# EAGLE design Thermal_Stage_rev3 (EAGLE 5.06)
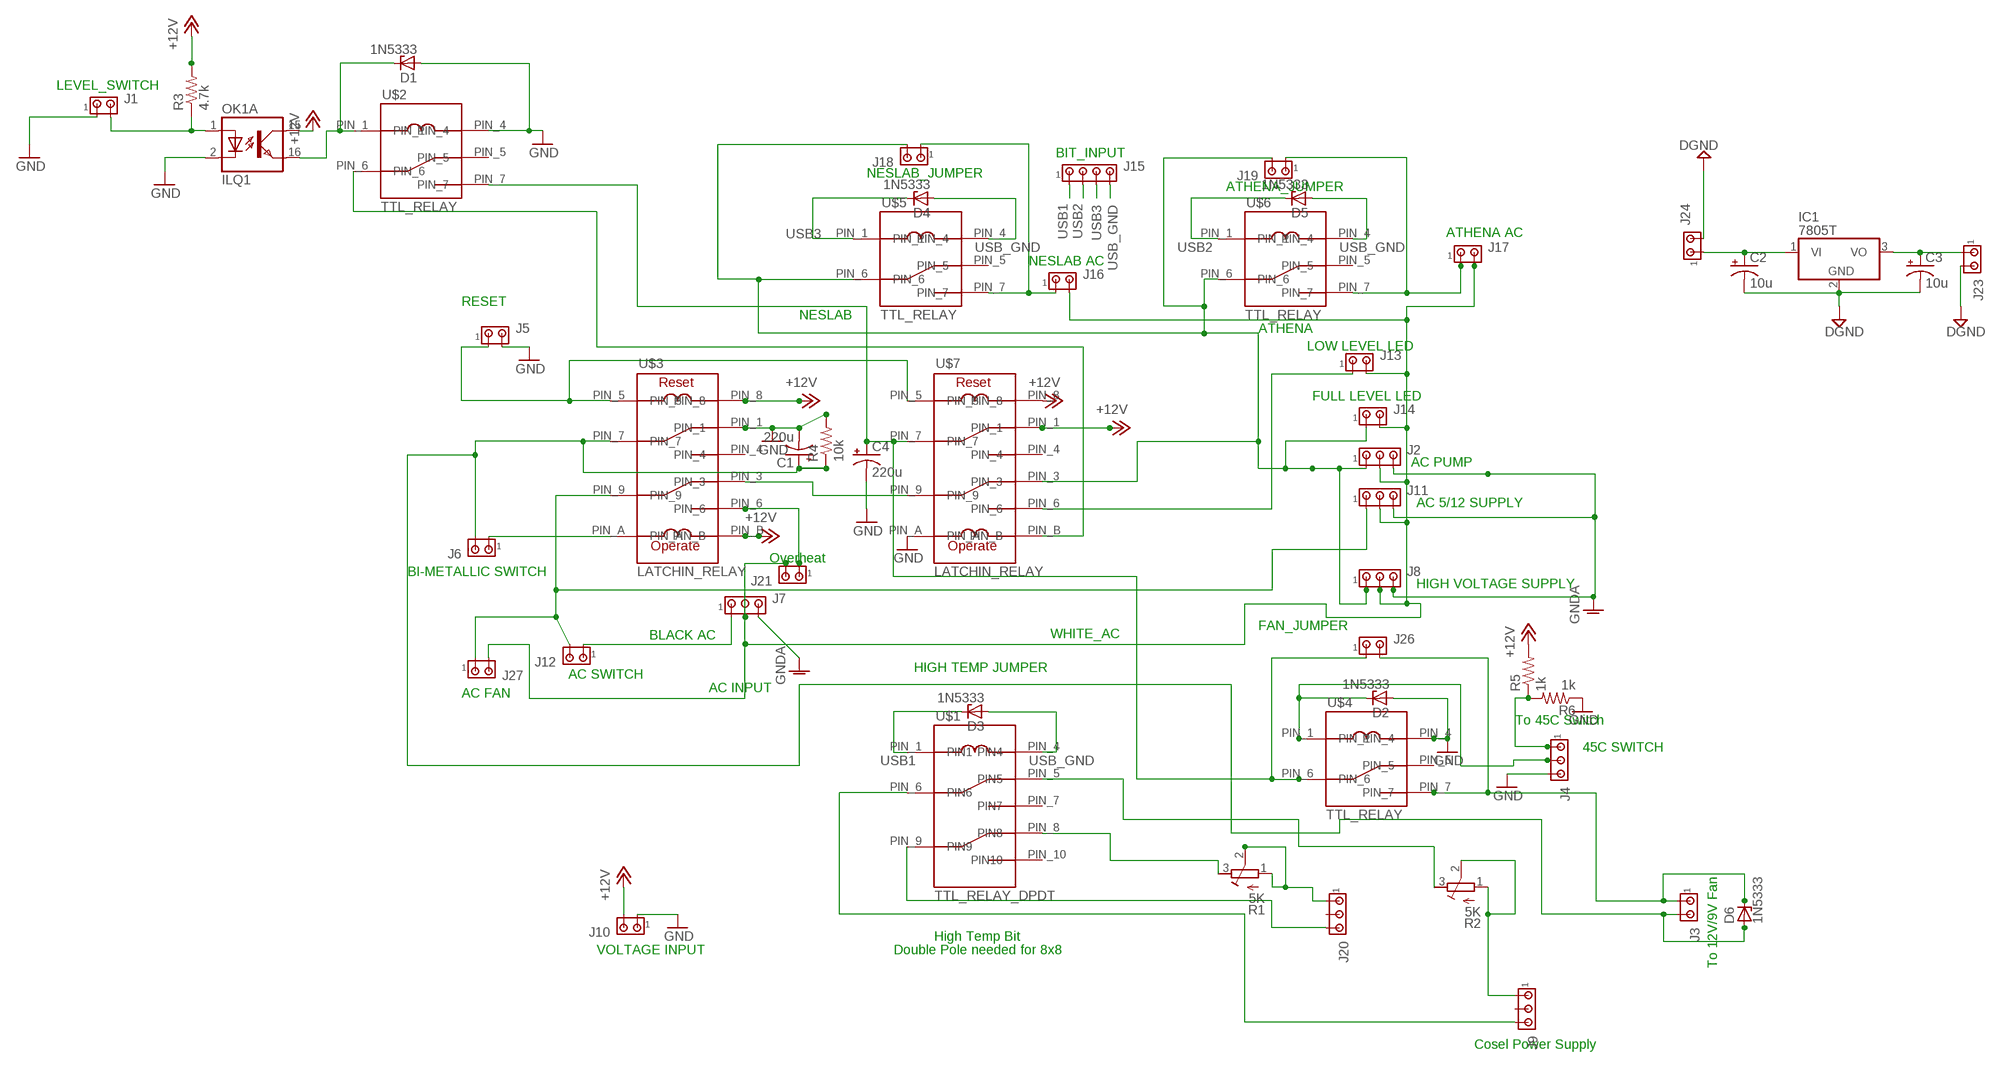
[diagram p0: schematic, sheet 1]

## Parts
C1  220u  CPOL-USE5-13  [E5-13]
C2  10u  CPOL-USE2,5-6E  [E2,5-6E]
C3  10u  CPOL-USE2,5-6E  [E2,5-6E]
C4  220u  CPOL-USE5-13  [E5-13]
D1  1N5333  [C1702-15]
D2  1N5333  [C1702-15]
D3  1N5333  [C1702-15]
D4  1N5333  [C1702-15]
D5  1N5333  [C1702-15]
D6  1N5333  [C1702-15]
IC1  7805T  [TO220H]
J1  MTA02-156  [1X2MTA]
J2  MTA03-156  [1X3MTA]
J3  MTA02-156  [1X2MTA]
J4  MTA03-156  [1X3MTA]
J5  MTA02-156  [1X2MTA]
J6  MTA02-156  [1X2MTA]
J7  MTA03-156  [1X3MTA]
J8  MTA03-156  [1X3MTA]
J9  MTA03-100  [10X03MTA]
J10  MTA02-156  [1X2MTA]
J11  MTA03-156  [1X3MTA]
J12  MTA02-156  [1X2MTA]
J13  MTA02-156  [1X2MTA]
J14  MTA02-156  [1X2MTA]
J15  MTA04-100  [10X04MTA]
J16  MTA02-156  [1X2MTA]
J17  MTA02-156  [1X2MTA]
J18  MTA02-100  [10X02MTA]
J19  MTA02-100  [10X02MTA]
J20  MTA03-100  [10X03MTA]
J21  MTA02-156  [1X2MTA]
J23  MTA02-100  [10X02MTA]
J24  MTA02-100  [10X02MTA]
J26  MTA02-100  [10X02MTA]
J27  MTA02-156  [1X2MTA]
OK1  ILQ1  [DIL16]
R1  5K  R-TRIMM3296W  [RTRIM3296W]
R2  5K  R-TRIMM3296W  [RTRIM3296W]
R3  4.7k  R-US_0204/7  [0204/7]
R4  10k  R-US_0204/7  [0204/7]
R5  1k  R-US_0204/7  [0204/7]
R6  1k  R-US_0204/7  [0204/7]
U$1  TTL_RELAY_DPDT  [TTL_RELAY_DPDT]
U$2  TTL_RELAY  [R1OS-E1Y1-J1.0K]
U$3  LATCHIN_RELAY  [785XBXCD-12D]
U$4  TTL_RELAY  [R1OS-E1Y1-J1.0K]
U$5  TTL_RELAY  [R1OS-E1Y1-J1.0K]
U$6  TTL_RELAY  [R1OS-E1Y1-J1.0K]
U$7  LATCHIN_RELAY  [785XBXCD-12D]

## Nets
+12V: J10.2 OK1.15(A:COL) R3.2 R5.2 U$3.PIN_8 U$3.PIN_B U$7.PIN_1 U$7.PIN_8
BLACK_AC: J7.1 J12.1
BLACK_AC_SWITCH: C1.+ D6.A J3.2 J6.2 R4.1 U$3.PIN_7
DGND: C2.- C3.- IC1.2(GND) J23.2 J24.2
GND: C1.- C4.- D1.A D2.A J1.1 J4.3 J5.2 J10.1 OK1.2(A:C) R4.2 R6.1 U$2.PIN_4 U$3.PIN_1 U$4.PIN_4 U$7.PIN_A
GNDA: J2.3 J7.3 J8.3 J11.3
N$1: D6.C J3.1 J26.2 U$4.PIN_7
N$2: J21.1 U$3.PIN_6
N$3: J20.1 R1.1(E) R1.2(S)
N$4: J5.1 U$3.PIN_5 U$7.PIN_5
N$5: U$2.PIN_6 U$7.PIN_B
N$6: J11.1 J12.2 J27.1 U$3.PIN_9
N$7: R1.3(A) U$1.PIN_8(PIN8)
N$8: D1.C OK1.16(A:EMIT) U$2.PIN_1
N$9: J13.1 U$7.PIN_6
N$10: J1.2 OK1.1(A:A) R3.1
N$11: C4.+ J26.1 U$2.PIN_7 U$4.PIN_6 U$7.PIN_7
N$12: J2.1 J8.1 J14.1 J18.2 J19.2 U$5.PIN_6 U$6.PIN_6 U$7.PIN_3
N$13: J9.3 U$1.PIN_6(PIN6)
N$14: J17.1 J19.1 U$6.PIN_7
N$15: J16.1 J18.1 U$5.PIN_7
N$17: D2.C J4.2 U$4.PIN_1
N$18: U$3.PIN_3 U$7.PIN_9
N$19: J20.3 U$1.PIN_9(PIN9)
N$20: J4.1 R5.1 R6.2
N$21: R2.3(A) U$1.PIN_5(PIN5)
N$22: J9.1 R2.1(E) R2.2(S)
N$24: C2.+ IC1.1(VI) J24.1
N$25: C3.+ IC1.3(VO) J23.1
N$26: J6.1 U$3.PIN_A
USB1: D3.C J15.1 U$1.PIN_1(PIN1)
USB2: D5.C J15.2 U$6.PIN_1
USB3: D4.C J15.3 U$5.PIN_1
USB_GND: D3.A D4.A D5.A J15.4 U$1.PIN_4(PIN4) U$5.PIN_4 U$6.PIN_4
WHITE_AC: J2.2 J7.2 J8.2 J11.2 J13.2 J14.2 J16.2 J17.2 J21.2 J27.2
Unconnected: J9.2 J20.2 OK1.3(B:C) OK1.4(B:A) OK1.5(C:A) OK1.6(C:C) OK1.7(D:C) OK1.8(D:A) OK1.9(D:EMIT) OK1.10(D:COL) OK1.11(C:COL) OK1.12(C:EMIT) OK1.13(B:EMIT) OK1.14(B:COL) U$1.PIN_7(PIN7) U$1.PIN_10(PIN10) U$2.PIN_5 U$3.PIN_4 U$4.PIN_5 U$5.PIN_5 U$6.PIN_5 U$7.PIN_4

## Notes on the sheet
- LEVEL_SWITCH
- BIT_INPUT
- NESLAB_JUMPER
- ATHENA_JUMPER
- ATHENA AC
- NESLAB AC
- RESET
- NESLAB
- ATHENA
- LOW LEVEL LED
- FULL LEVEL LED
- AC PUMP
- AC 5/12 SUPPLY
- Overheat
- BI-METALLIC SWITCH
- HIGH VOLTAGE SUPPLY
- FAN_JUMPER
- BLACK AC | WHITE_AC
- HIGH TEMP JUMPER
- AC SWITCH
- AC INPUT
- AC FAN
- To 45C Switch
- 45C SWITCH
- High Temp Bit
- VOLTAGE INPUT | Double Pole needed for 8x8
- To 12V/9V Fan
- Cosel Power Supply

## Library data of the parts
C1-C4 = rcl:CPOL-US: POLARIZED CAPACITOR, American symbol
D1-D6 = diode:1N5333: Z DIODE 3.3 V, 5W, 5 percent (Motorola)
IC1 = linear:78*: Positive VOLTAGE REGULATOR Source: http://cache.national.com/ds/LM/LM78L05.pdf http://www.fairchildsemi.com/ds/LM/LM7805.pdf
J1 J3 J5 J6 J10 J12-J14 J16 J17 J21 J27 = con-amp:MTA02-156: AMP connector; OC_FARNELL: unknown; OC_NEWARK: unknown
J2 J4 J7 J8 J11 = con-amp:MTA03-156: AMP connector; OC_FARNELL: unknown; OC_NEWARK: unknown
J9 J20 = con-amp:MTA03-100: AMP connector; OC_FARNELL: unknown; OC_NEWARK: unknown
J15 = con-amp:MTA04-100: AMP connector; OC_FARNELL: unknown; OC_NEWARK: unknown
J18 J19 J23 J24 J26 = con-amp:MTA02-100: AMP connector; OC_FARNELL: unknown; OC_NEWARK: unknown
OK1 = optocoupler:ILQ1: SIEMENS OPTO COUPLER
R1 R2 = resistor:R-TRIMM: Trimm resistor
R3-R6 = rcl:R-US_: RESISTOR, American symbol
U$1 = Anthony-Relay:TTL_RELAY_DPDT
U$2 U$4-U$6 = Anthony-Relay:TTL_RELAY
U$3 U$7 = Anthony-Relay:LATCHIN_RELAY

## Board
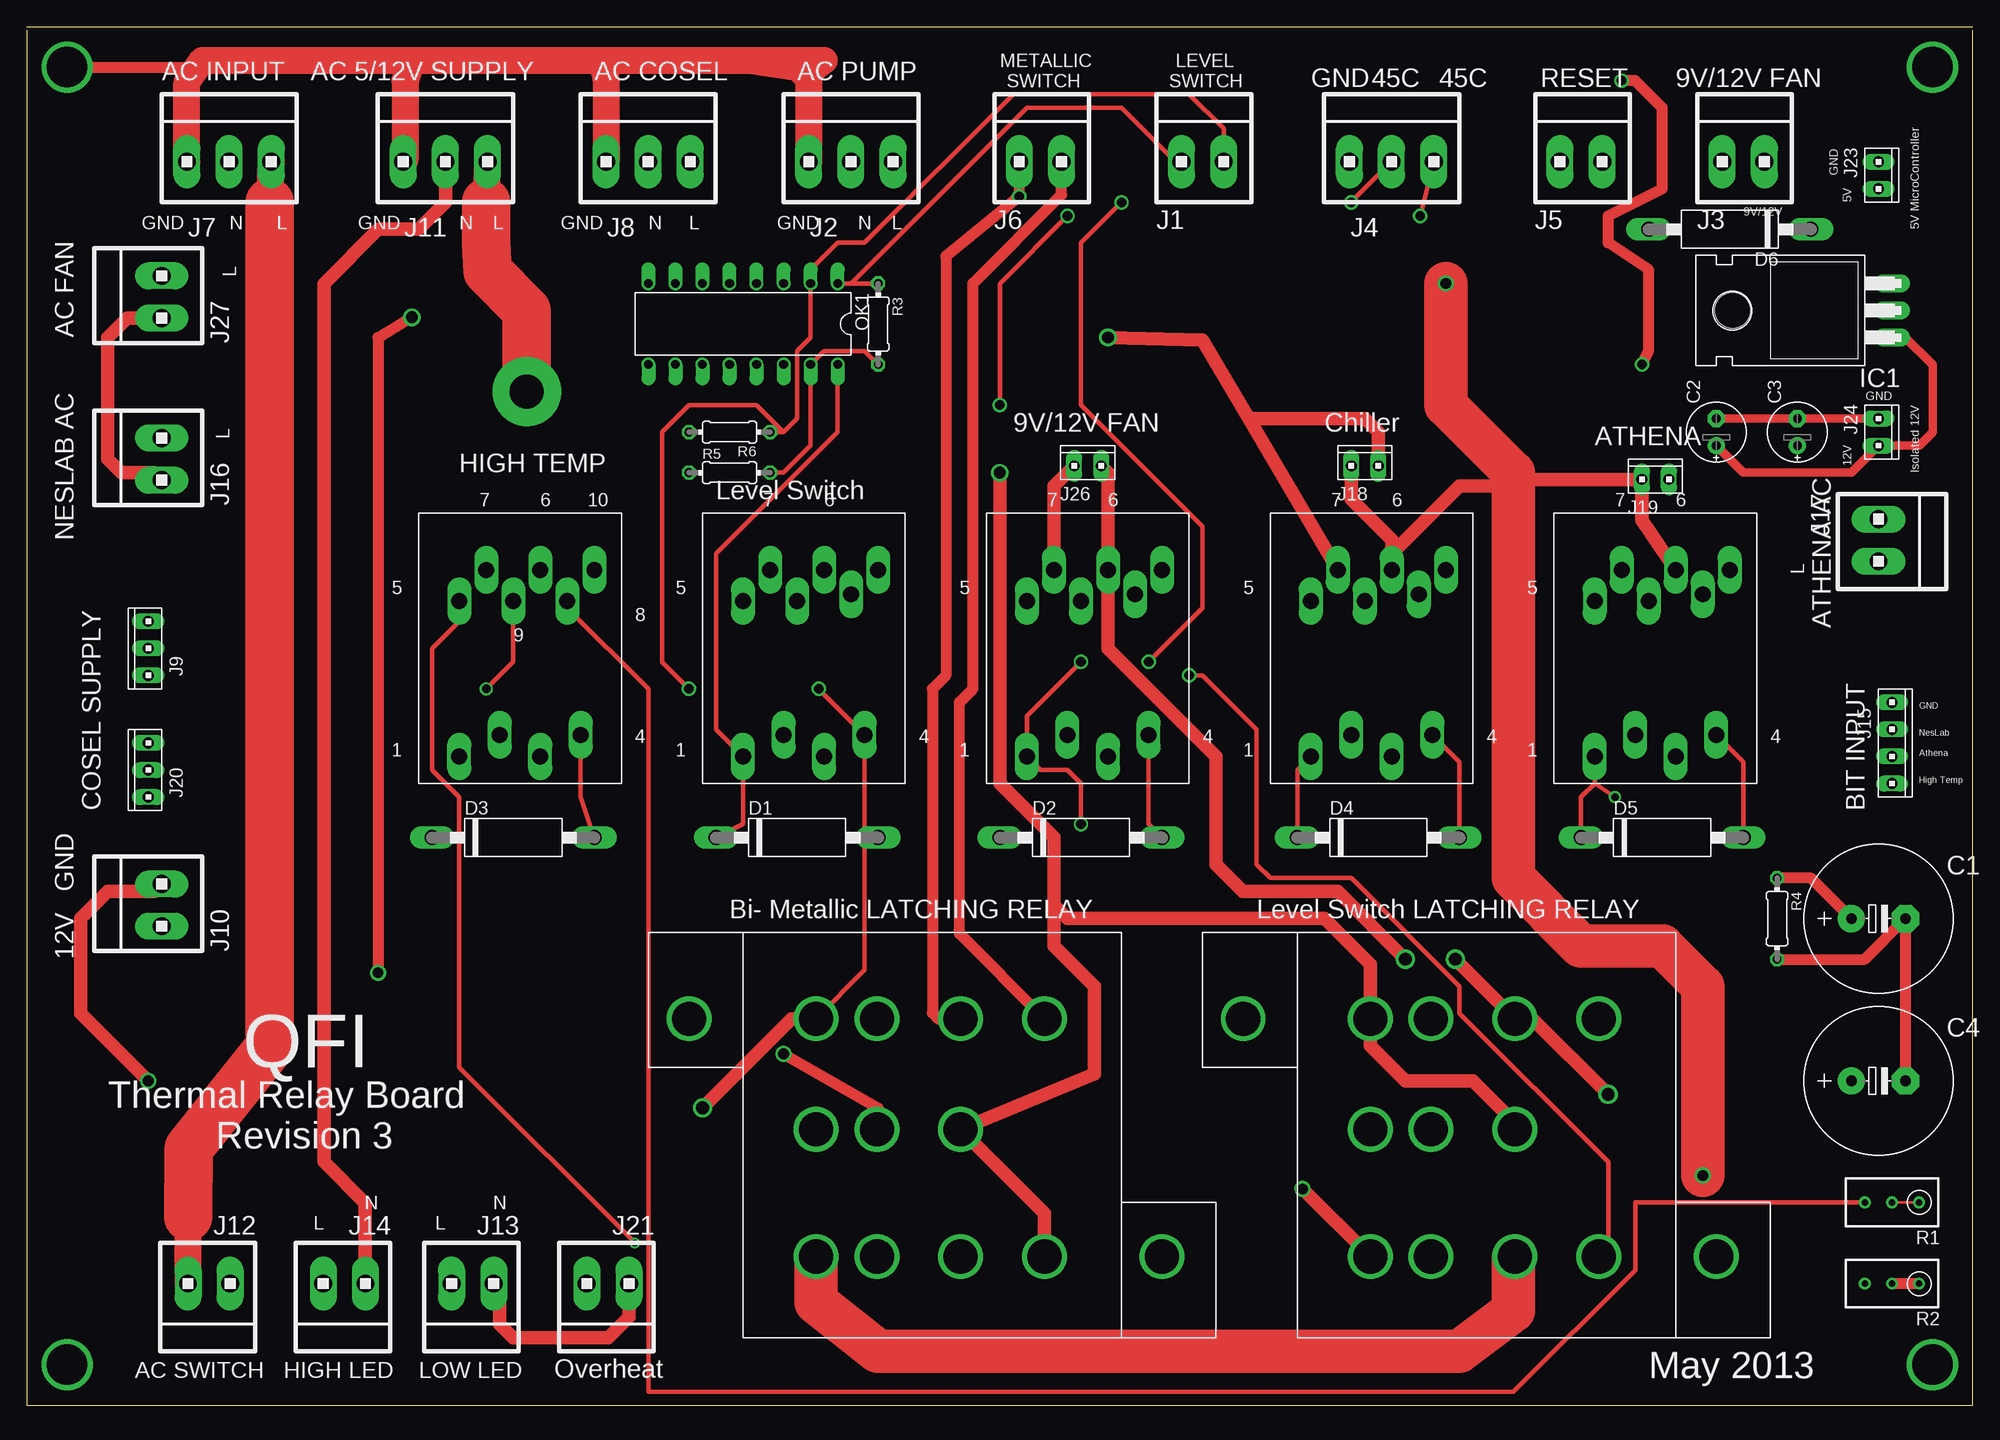
[diagram p1: board, top side]
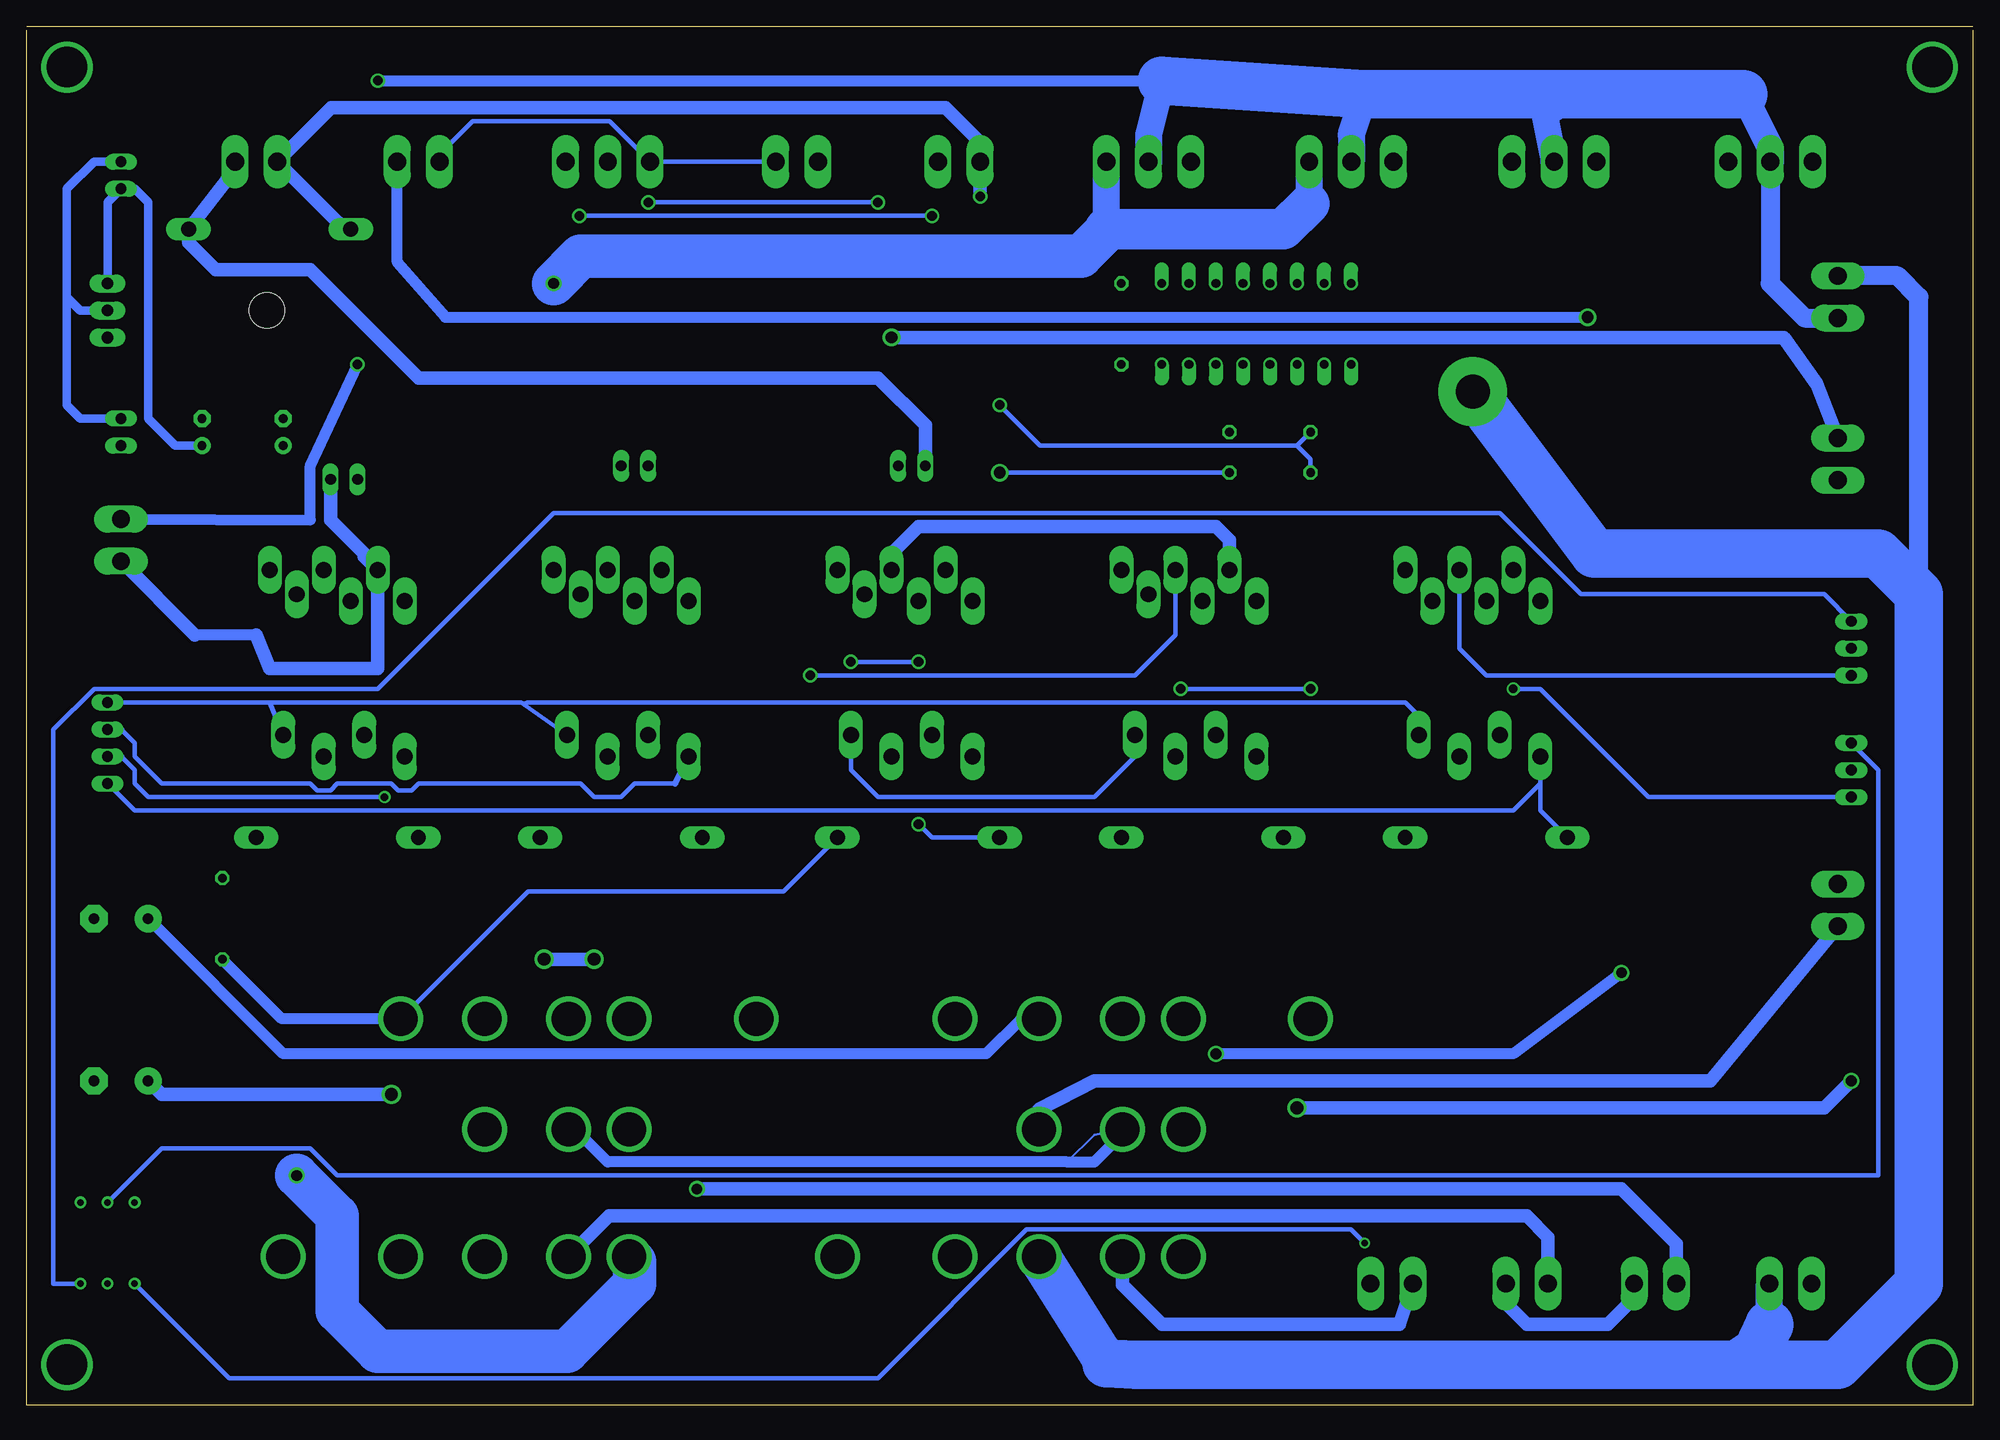
[diagram p2: board, bottom side, seen from below]

Size 182.86 x 129.54 mm. Coordinates in mm from the lower left corner, seen from the top.
Outline: 182.86,129.21 182.86,0 0,0 0,129.21
Outline: 0,129.54 182.86,129.54
Copper layers (1*16): Top 0.035mm / dielectric 1.5mm / Bottom 0.035mm
Design rules "default": minimum track width 10mil, minimum drill 24mil, track to track 8mil, track to pad 8mil, pad to pad 8mil, via to via 8mil, smd to smd 8mil, copper to edge 40mil, drill to drill 8mil, minimum pad ring 10mil, minimum via ring 8mil, stop-mask expansion 4mil, vias tented up to drill 0mil, thermal gap 10mil

### Footprints (pad centres in the part's own frame; a part is rotated, then mirrored left to right if it is on the bottom)
E5-13 = drill 1.016 pad 2.54 round: + -2.54,0 | drill 1.016 pad 2.54 octagon: - 2.54,0
E2,5-6E = drill 0.813 pad 1.575 round: + -1.27,0 | drill 0.813 pad 1.575 octagon: - 1.27,0
C1702-15 = drill 1.397 long: A 7.62,0; C -7.62,0
TO220H = drill 1.118 long: 1 -2.54,-10.16; 2 0,-10.16; 3 2.54,-10.16 | hole 3.302: 0,4.826
1X2MTA = drill 1.676 long: 1 1.981,0; 2 -1.981,0
1X3MTA = drill 1.676 long: 1 3.937,0; 2 -0.025,0; 3 -3.988,0
10X03MTA = drill 1.016 long: 1 2.54,0; 2 0,0; 3 -2.54,0
10X04MTA = drill 1.016 long: 1 3.81,0; 2 1.27,0; 3 -1.27,0; 4 -3.81,0
10X02MTA = drill 1.016 long: 1 1.27,0; 2 -1.27,0
DIL16 = drill 0.813 offset: 1 -8.89,-3.81; 2 -6.35,-3.81; 3 -3.81,-3.81; 4 -1.27,-3.81; 5 1.27,-3.81; 6 3.81,-3.81; 7 6.35,-3.81; 8 8.89,-3.81; 9 8.89,3.81; 10 6.35,3.81; 11 3.81,3.81; 12 1.27,3.81; 13 -1.27,3.81; 14 -3.81,3.81; 15 -6.35,3.81; 16 -8.89,3.81
RTRIM3296W = drill 0.61 round: 1 0,-2.54; 2 0,0; 3 0,2.54
0204/7 = drill 0.813 octagon: 1 -3.81,0; 2 3.81,0
TTL_RELAY_DPDT = drill 1.5 long: P$2 -5.08,-8.128; P$3 -1.27,-10.16; PIN_1 -8.89,-10.16; PIN_4 2.54,-8.128; PIN_5 -8.89,4.445; PIN_6 -1.27,7.366; PIN_7 -6.35,7.366; PIN_8 1.27,4.445; PIN_9 -3.81,4.445; PIN_10 3.81,7.366
R1OS-E1Y1-J1.0K = drill 1.5 long: 89 8.89,17.145; P$2 7.62,4.572; P$3 11.43,2.54; P$9 13.97,17.78; P$10 16.51,20.066; PIN_1 3.81,2.54; PIN_4 15.24,4.572; PIN_5 3.81,17.145; PIN_6 11.43,20.066; PIN_7 6.35,20.066
785XBXCD-12D = drill 3.2 round: P$6 7.62,-3.81; P$14 29.972,40.64; PIN_1 29.972,28.702; PIN_2 19.558,28.702; PIN_3 7.62,28.702; PIN_4 29.972,22.987; PIN_5 19.558,22.987; PIN_6 7.62,22.987; PIN_7 29.972,15.113; PIN_8 19.558,15.113; PIN_9 7.62,15.113; PIN_A 29.972,7.239; PIN_B 7.62,7.239

### Placement (x,y rotation side)
C1  173.99,45.72 0 top
C2  158.75,91.44 90 top
C3  166.37,91.44 90 top
C4  173.99,30.48 0 top
D1  72.39,53.34 0 top
D2  99.06,53.34 0 top
D3  45.72,53.34 0 top
D4  127,53.34 0 top
D5  153.67,53.34 0 top
D6  160.02,110.49 180 top
IC1  165.1,102.87 90 top
J1  110.49,116.84 0 top
J2  77.47,116.84 0 top
J3  161.29,116.84 0 top
J4  128.27,116.84 0 top
J5  146.05,116.84 0 top
J6  95.25,116.84 0 top
J7  19.05,116.84 0 top
J8  58.42,116.84 0 top
J9  11.43,71.12 90 top
J10  12.7,46.99 90 top
J11  39.37,116.84 0 top
J12  17.14,11.43 180 top
J13  41.91,11.43 180 top
J14  29.84,11.43 180 top
J15  175.26,62.23 270 top
J16  12.7,88.9 90 top
J17  173.99,81.28 270 top
J18  125.73,88.27 0 top
J19  153.03,87 0 top
J20  11.43,59.69 90 top
J21  54.61,11.43 180 top
J23  173.99,115.57 270 top
J24  173.99,91.44 270 top
J26  99.69,88.27 0 top
J27  12.7,104.14 90 top
OK1  67.31,101.6 180 top
R1  175.26,19.05 90 top
R2  175.26,11.43 90 top
R3  80.01,101.6 270 top
R4  164.47,45.72 270 top
R5  66.04,87.63 0 top
R6  66.04,91.44 180 top
U$1  49.53,71.12 0 top
U$2  63.5,58.42 0 top
U$3  102.87,6.35 90 top
U$4  90.17,58.42 0 top
U$5  116.84,58.42 0 top
U$6  143.51,58.42 0 top
U$7  154.94,6.35 90 top

### Tracks (layer width: path | path; a pad name or v marks a point on that pad's centre or on a via)
+12V  (via drill 1.1)
  Top 0.406: R3.2 78.74,99.06 74.93,99.06 OK1.15 73.66,90.17 71.12,87.63 R5.2
  Top 1.27: U$3.PIN_B 95.63,18.03 U$3.PIN_8 100.33,31.11 100.33,39.37 96.52,43.18 96.52,46.99 | 96.52,46.99 96.52,53.34 91.44,58.42 v91.44,87.63 | 96.52,46.99 97.79,45.72 121.92,45.72 126.24,41.4 U$7.PIN_1 126.24,33.78 129.54,30.48 135.89,30.48 139.7,26.67 139.7,26.04 U$7.PIN_8
  Bottom 0.406: v91.44,87.63 R5.2
  Bottom 1.27: J10.2 24.69,30.48 82.55,30.48 87.76,27.81 U$3.PIN_8
BLACK_AC
  Top 2.54: 22.86,113.03 J7.1 | J12.1 15.16,17.7
  Top 4.572: 22.86,113.03 22.86,33.66 15.24,24.13 15.16,17.7
BLACK_AC_SWITCH  (via drill 0.9)
  Top 1.016: J6.2 v93.27,113.59 86.36,107.95 86.36,68.58 85.09,67.31 85.09,36.83 85.6,36.32 U$3.PIN_7 | R4.1 167.64,49.53 C1.+
  Bottom 1.016: U$3.PIN_7 89.41,36.32 92.71,33.02 158.75,33.02 C1.+
  Bottom 1.27: v93.27,113.59 93.27,118.67 96.52,121.92 154.23,121.92 J3.2 153.67,111.2 D6.A
DGND
  Top 0.813: J24.2 C3.- C2.-
  Bottom 0.813: J23.2 176.53,116.84 179.07,114.3 179.07,104.14 | 179.07,104.14 177.8,102.87 IC1.2 | J24.2 177.8,92.71 179.07,93.98 179.07,104.14
GND  (via drill 0.9, 1, 1.2)
  Top 0.406: U$4.PIN_4 105.41,54.61 D2.A | J1.1 112.47,119.94 109.22,123.19 92.71,123.19 78.74,109.22 76.2,109.22 73.66,106.68 OK1.2 73.66,100.33 72.39,99.06 72.39,92.71 71.12,91.44 | 71.12,91.44 R6.1 | 71.12,91.44 68.58,93.98 62.23,93.98 59.69,91.44 59.69,69.85 v62.23,67.31 | v74.42,67.31 U$2.PIN_4 78.74,53.34 | 78.74,53.34 78.74,40.89 U$3.PIN_1 | 78.74,53.34 D1.A
  Top 1.016: C4.- C1.- 172.72,41.91 R4.2
  Top 1.27: U$3.PIN_1 71.88,36.32 v63.5,27.94 | v11.43,30.48 5.08,36.83 5.08,45.72 7.62,48.26 11.99,48.26 J10.1
  Bottom 0.406: v62.23,67.31 v74.42,67.31 | U$4.PIN_4 105.41,59.69 102.87,57.15 82.55,57.15 78.74,60.96 U$2.PIN_4 | J4.3 J1.1 | J4.3 124.46,116.84 | D2.A 111.76,48.26 135.76,48.26 U$7.PIN_A | J5.2 144.07,117.55 140.97,120.65 128.09,120.65 J4.3
  Bottom 1.016: U$7.PIN_A 158.88,36.32 R4.2
  Bottom 1.27: v63.5,27.94 13.97,27.94 v11.43,30.48
GNDA
  Top 2.54: J7.3 15.06,124.28 16.51,126.36 36.2,126.36 | 36.2,126.36 35.56,124.46 35.56,117.02 J11.3 | J8.3 54.43,124.64 53.98,126.36 | 36.2,126.36 53.98,126.36 | J2.3 73.48,124.64 72.39,125.73 67.94,126.36 | 53.98,126.36 67.94,126.36 | 73.48,125.27 74.93,126.36 67.94,126.36
N$1
  Top 1.27: U$4.PIN_7 96.52,86.36 J26.2
  Bottom 1.27: J3.1 163.27,116.13 D6.C 167.64,109.22 165.1,106.68 156.21,106.68 146.05,96.52 102.87,96.52 98.42,92.08 J26.2
N$2
  Bottom 1.27: U$3.PIN_6 79.88,11.3 76.2,7.62 53.9,7.62 J21.1
N$3
  Top 0.254: R1.2 R1.1
  Bottom 0.406: J20.1 8.89,59.69 8.89,21.59 153.67,21.59 156.21,24.13 170.18,24.13 R1.2
N$4  (via drill 1, 1.1)
  Top 1.016: v71.12,33.02 80.01,27.94 80.01,26.04 U$3.PIN_5 | v33.02,40.64 33.02,100.33 v36.2,102.23
  Bottom 0.254: 85.09,22.86 82.55,25.4 U$3.PIN_5
  Bottom 1.016: v71.12,33.02 43.18,33.02 v33.02,40.64 | v36.2,102.23 143.51,102.23 148.03,107.39 J5.1 | 131.32,25.91 128.27,22.86 85.09,22.86 82.55,22.86 80.01,25.4
  Bottom 1.27: 131.32,25.91 U$7.PIN_5
N$5  (via drill 0.9)
  Top 0.406: v109.22,68.58 110.49,68.58 115.57,63.5 115.57,50.8 116.84,49.53 124.46,49.53 134.62,39.37 134.62,36.83 148.59,22.86 148.59,14.86 U$7.PIN_B
  Bottom 0.406: U$2.PIN_6 74.93,72.39 78.74,68.58 v109.22,68.58
N$6  (via drill 3.2 pad 6.45)
  Top 2.54: 43.18,113.03 J11.1
  Top 4.572: 43.18,113.03 43.18,109.22 43.31,106.55 46.99,102.87 v46.99,95.25
  Bottom 1.778: J27.1 7.06,106.12 5.08,104.14 5.08,74.93
  Bottom 2.54: 19.13,7.54 J12.2
  Bottom 4.064: 81.41,3.94 U$3.PIN_9
  Bottom 4.572: 22.23,3.81 20.32,5.08 19.13,7.54 | 22.23,3.81 78.74,3.81 81.41,3.94 | v46.99,95.25 35.56,80.01 8.89,80.01 5.08,76.2 5.08,74.93 5.08,11.43 12.7,3.81 22.23,3.81 | 22.23,3.81 27.94,3.81
N$7
  Top 0.406: R1.3 151.13,19.05 151.13,12.7 139.7,1.27 58.42,1.27 58.42,67.31 50.8,74.93 U$1.PIN_8
N$8
  Top 0.406: OK1.16 76.2,91.44 64.77,80.01 64.77,63.5 U$2.PIN_1 67.31,54.61 D1.C
N$9
  Bottom 1.27: J13.1 39.93,15.8 41.91,17.78 128.14,17.78 U$7.PIN_6
N$10
  Top 0.406: J1.2 107.95,116.84 102.87,121.92 93.98,121.92 77.47,105.41 | OK1.1 77.47,105.41 | 77.47,105.41 R3.1
N$11  (via drill 1.2)
  Top 1.27: J26.1 101.6,87.63 U$4.PIN_6 101.6,71.12 111.76,60.96 111.76,50.8 114.3,48.26 123.19,48.26 v129.54,41.91 | v134.24,41.91 U$7.PIN_7 141.48,36.32 v148.59,29.21
  Bottom 1.27: U$2.PIN_7 69.85,81.28 71.12,82.55 99.06,82.55 101.6,80.01 U$4.PIN_6 | v129.54,41.91 v134.24,41.91 | v148.59,29.21 170.18,29.21 C4.+
N$12  (via drill 1)
  Top 1.27: U$6.PIN_6 151.76,83.19 J19.2 140.34,87 139.7,86.36 134.62,86.36 128.27,80.01 U$5.PIN_6 128.27,81.28 124.46,85.09 J18.2 | v119.89,20.32 U$7.PIN_3
  Top 4.064: v133.35,105.41 133.35,93.98 139.7,87.63 139.7,86.36 139.7,49.53 146.05,43.18 153.67,43.18 157.48,39.37 v157.48,21.59
  Bottom 1.27: J14.1 27.86,15.16 33.02,20.32 v119.89,20.32
  Bottom 2.54: 81.41,110.49 J2.1 | 62.36,112.9 J8.1
  Bottom 3.81: 62.36,112.9 64.77,110.49 81.41,110.49
  Bottom 4.064: 81.41,110.49 81.41,110.36 83.82,107.95 130.81,107.95 v133.35,105.41 | v157.48,21.59 153.67,17.78 153.67,8.89 149.86,5.08 132.08,5.08 125.73,11.43 125.73,13.46 U$7.PIN_3
N$13
  Bottom 0.406: U$1.PIN_6 48.26,71.12 45.72,68.58 J9.3
N$14
  Bottom 1.016: 161.29,72.39 167.08,72.39
  Bottom 1.27: 167.08,72.39 J17.1 | 161.29,72.39 160.02,69.22 149.86,69.22 U$6.PIN_7 151.13,79.76 151.13,80.01 154.31,83.19 J19.1
N$15  (via drill 1.1)
  Top 1.27: 115.02,92.38 110.49,100.08 v101.6,100.33 | 115.02,92.38 U$5.PIN_7 | J18.1 127,91.44 125.73,92.71 115.34,92.71 115.02,92.38
  Bottom 1.27: v101.6,100.33 17.78,100.33 14.68,95.96 J16.1
N$17  (via drill 0.9)
  Top 0.406: v99.06,54.61 99.06,58.42 97.79,59.69 95.25,59.69 U$4.PIN_1 93.98,64.77 v99.06,69.85 | v105.41,69.85 110.49,74.93 110.49,82.55 99.06,93.98 99.06,109.22 v102.87,113.03 | v124.44,113.03 J4.2
  Bottom 0.406: D2.C 97.79,53.34 v99.06,54.61 | v99.06,69.85 v105.41,69.85 | v102.87,113.03 v124.44,113.03
N$18
  Top 4.064: U$3.PIN_3 74.17,9.65 80.01,5.08 134.62,5.08 139.7,8.89 139.7,13.84 U$7.PIN_9
N$19  (via drill 0.8)
  Top 0.406: U$1.PIN_9 45.72,69.85 v43.18,67.31
  Bottom 0.406: v43.18,67.31 40.64,67.31 30.48,57.15 J20.3
N$20  (via drill 0.9)
  Top 0.406: v91.44,93.98 91.44,105.41 v97.79,111.76 | v130.94,111.76 J4.1
  Bottom 0.406: 63.5,90.17 R6.2 | 63.5,90.17 87.63,90.17 v91.44,93.98 | v97.79,111.76 v130.94,111.76 | R5.1 62.23,88.9 63.5,90.17
N$21  (via drill 0.61)
  Top 0.406: v57.15,15.24 40.64,31.75 40.64,57.15 38.1,59.69 38.1,71.12 40.64,73.66 U$1.PIN_5
  Bottom 0.406: R2.3 163.83,2.54 102.87,2.54 88.9,16.51 58.42,16.51 v57.15,15.24
N$22
  Top 1.016: R2.1 R2.2
  Bottom 0.406: J9.1 13.97,76.2 36.83,76.2 44.45,83.82 133.35,83.82 149.86,67.31 176.53,67.31 180.34,63.5 180.34,11.43 R2.1
N$24
  Top 0.813: IC1.1 176.53,100.33 179.07,97.79 179.07,91.44 177.8,90.17 J24.1 171.45,87.63 161.29,87.63 C2.+
N$25
  Bottom 0.813: IC1.3 175.26,113.03 J23.1 172.72,114.3 171.45,113.03 171.45,92.71 168.91,90.17 C3.+
N$26
  Top 1.016: J6.1 97.23,113.74 88.9,105.41 88.9,67.31 87.63,66.04 87.63,44.32 U$3.PIN_A
S$1  (via drill 3.8 pad 1.27)
  other vias: 179.07,125.73
S$2  (via drill 3.8 pad 1.27)
  other vias: 3.81,125.73
S$3  (via drill 3.8 pad 1.27)
  other vias: 3.81,3.81
S$4  (via drill 3.8 pad 1.27)
  other vias: 179.07,3.81
S$5
  Top 1.016: 5.08,125.73 15.24,125.73
USB1
  Bottom 0.406: 40.64,58.42 40.64,55.88 D3.C | 40.64,58.42 U$1.PIN_1 | J15.1 172.72,55.88 43.18,55.88 40.64,58.42
USB2  (via drill 0.7)
  Top 0.406: 147.32,58.42 v149.22,57.15 | 147.32,58.42 U$6.PIN_1 | D5.C 146.05,57.15 147.32,58.42
  Bottom 0.406: 173.99,60.96 172.72,59.69 172.72,58.42 171.45,57.15 v149.22,57.15
  Bottom 0.61: 173.99,60.96 J15.2
USB3
  Top 0.406: D4.C 119.38,59.69 U$5.PIN_1
  Bottom 0.406: 173.99,63.5 172.72,62.23 172.72,60.96 170.18,58.42 156.21,58.42 155.57,57.78 154.31,57.78 153.67,58.42 148.59,58.42 147.96,57.78 146.69,57.78 146.05,58.42 130.81,58.42 129.54,57.15 127,57.15 125.73,58.42 121.92,58.42
  Bottom 0.61: 173.99,63.5 J15.3 | U$5.PIN_1 121.92,58.42
USB_GND
  Top 0.406: U$1.PIN_4 52.07,57.15 D3.A | D4.A 134.62,60.45 U$5.PIN_4 | D5.A 161.29,60.45 U$6.PIN_4
  Bottom 0.254: 134.62,66.04 137.16,66.04
  Bottom 0.406: 160.02,66.04 173.99,66.04 | 160.02,66.04 U$6.PIN_4 | U$5.PIN_4 136.4,66.04 137.16,66.04 160.02,66.04 | U$1.PIN_4 52.07,64.77 53.34,66.04 134.62,66.04 135.82,66.04 136.06,65.8
  Bottom 0.61: 173.99,66.04 J15.4
WHITE_AC  (via drill 0.9)
  Top 1.016: v151.76,97.79 152.4,99.06 152.4,106.68 148.59,109.22 148.59,111.76 153.67,114.3 153.67,121.92 151.13,124.46 v149.86,124.46
  Top 1.27: J21.2 56.59,8.33 54.61,6.35 45.72,6.35 44.45,7.62 44.45,10.87 J13.2 | J27.2 9.45,102.16 7.62,100.33 7.62,88.9 8.89,87.63 11.99,87.63 J16.2 | J14.2 31.83,18.97 27.94,22.86 27.94,105.41 33.02,110.49 36.83,110.49 39.37,113.03 39.37,116.81 J11.2
  Bottom 1.016: v149.86,124.46 76.2,124.46 | J17.2 156.21,83.19 156.21,88.27 v151.76,97.79
  Bottom 1.27: J2.2 77.47,116.84 | 58.42,119.38 58.4,119.36 | J14.2 31.83,10.08 34.29,7.62 41.91,7.62 44.45,10.16 44.45,10.87 J13.2
  Bottom 1.778: J27.2 15.8,102.16 19.05,105.41 19.05,116.81 J7.2
  Bottom 2.54: J2.2 77.44,119.41 76.2,124.46 | 57.15,123.19 58.42,119.38 | J11.2 39.37,116.86 40.64,123.19 39.34,121.89 | 21.59,123.19 19.05,118.14 J7.2 | 58.4,119.36 J8.2
  Bottom 4.572: 21.59,123.19 40.64,123.19 57.15,123.19 76.2,124.46

### Text on the board
tPlace: METALLIC | LEVEL | AC INPUT | AC 5/12V SUPPLY | AC COSEL | AC PUMP | SWITCH | SWITCH | GND | 45C | 45C | RESET | AC FAN | 9V/12V FAN | Chiller | ATHENA | HIGH TEMP | NESLAB AC | ATHENA AC | COSEL SUPPLY | BIT INPUT | GND | Bi- Metallic LATCHING RELAY | Level Switch LATCHING RELAY | 12V | AC SWITCH | HIGH LED | LOW LED
tNames: 9V/12V FAN | GND | 5V | 9V/12V | GND | N | L | GND | N | L | GND | N | L | GND | N | L | 5V MicroController | L | GND | L | 12V | Isolated 12V | Level Switch | L | GND | NesLab | Athena | High Temp | QFI | Thermal Relay Board | Revision 3 | L | N | L | N | Overheat | May 2013